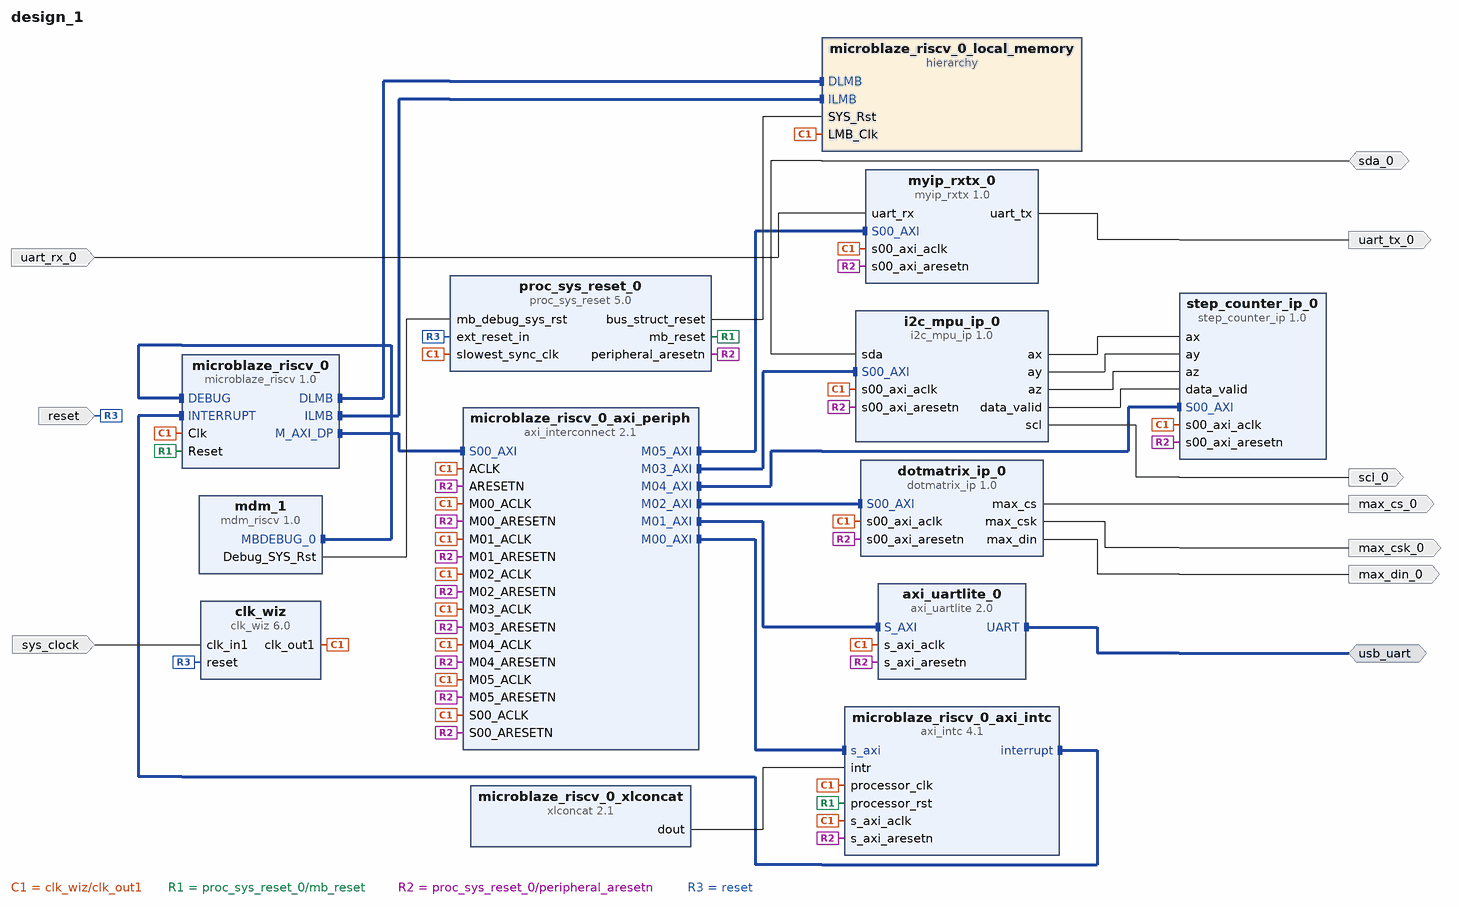
[diagram p0: block diagram of the top level]
# Vivado block design design_1, xc7a35tcpg236-1, Vivado 2024.2
create_bd_design design_1

create_bd_intf_port -mode Master -vlnv xilinx.com:interface:uart_rtl:1.0 usb_uart
create_bd_port -dir I -type rst reset
set_property -dict {CONFIG.POLARITY ACTIVE_HIGH} [get_bd_ports reset]
create_bd_port -dir I -type clk sys_clock
set_property -dict {CONFIG.FREQ_HZ 100000000 CONFIG.PHASE 0.0} [get_bd_ports sys_clock]
create_bd_port -dir O max_cs_0
create_bd_port -dir O max_csk_0
create_bd_port -dir O max_din_0
create_bd_port -dir O scl_0
create_bd_port -dir IO sda_0
create_bd_port -dir I uart_rx_0
create_bd_port -dir O uart_tx_0

create_bd_cell -type ip -vlnv xilinx.com:ip:proc_sys_reset:5.0 proc_sys_reset_0
set_property -dict {CONFIG.RESET_BOARD_INTERFACE reset CONFIG.USE_BOARD_FLOW true} [get_bd_cells proc_sys_reset_0]
create_bd_cell -type ip -vlnv xilinx.com:ip:clk_wiz:6.0 clk_wiz
set_property -dict [list \
  CONFIG.CLKOUT1_REQUESTED_OUT_FREQ 100.0 \
  CONFIG.CLK_IN1_BOARD_INTERFACE sys_clock \
  CONFIG.RESET_BOARD_INTERFACE reset \
  CONFIG.USE_BOARD_FLOW true \
] [get_bd_cells clk_wiz]
create_bd_cell -type ip -vlnv xilinx.com:ip:microblaze_riscv:1.0 microblaze_riscv_0
set_property -dict {CONFIG.C_DEBUG_ENABLED 1 CONFIG.C_D_AXI 1 CONFIG.C_D_LMB 1 CONFIG.C_I_LMB 1} [get_bd_cells microblaze_riscv_0]
create_bd_cell -type hier microblaze_riscv_0_local_memory
create_bd_cell -type ip -vlnv xilinx.com:ip:axi_interconnect:2.1 microblaze_riscv_0_axi_periph
set_property -dict {CONFIG.NUM_MI 6} [get_bd_cells microblaze_riscv_0_axi_periph]
create_bd_cell -type ip -vlnv xilinx.com:ip:axi_intc:4.1 microblaze_riscv_0_axi_intc
set_property -dict {CONFIG.C_HAS_FAST 1} [get_bd_cells microblaze_riscv_0_axi_intc]
create_bd_cell -type ip -vlnv xilinx.com:ip:xlconcat:2.1 microblaze_riscv_0_xlconcat
create_bd_cell -type ip -vlnv xilinx.com:ip:mdm_riscv:1.0 mdm_1
create_bd_cell -type ip -vlnv xilinx.com:ip:axi_uartlite:2.0 axi_uartlite_0
set_property -dict {CONFIG.UARTLITE_BOARD_INTERFACE usb_uart CONFIG.USE_BOARD_FLOW true} [get_bd_cells axi_uartlite_0]
create_bd_cell -type ip -vlnv user.org:user:dotmatrix_ip:1.0 dotmatrix_ip_0
create_bd_cell -type ip -vlnv user.org:user:i2c_mpu_ip:1.0 i2c_mpu_ip_0
create_bd_cell -type ip -vlnv user.org:user:step_counter_ip:1.0 step_counter_ip_0
create_bd_cell -type ip -vlnv user.org:user:myip_rxtx:1.0 myip_rxtx_0

# ---- hierarchy /microblaze_riscv_0_local_memory ----
current_bd_instance /microblaze_riscv_0_local_memory
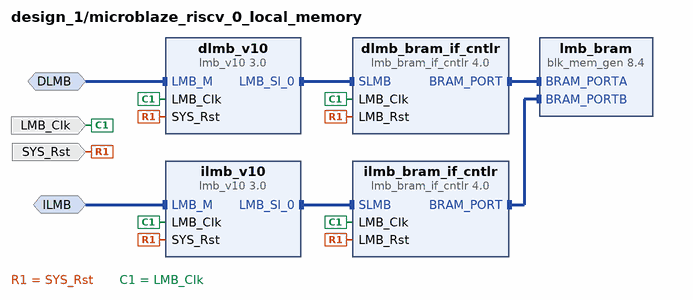
[diagram p1: block diagram inside /microblaze_riscv_0_local_memory]
create_bd_intf_pin -mode MirroredMaster -vlnv xilinx.com:interface:lmb_rtl:1.0 DLMB
create_bd_intf_pin -mode MirroredMaster -vlnv xilinx.com:interface:lmb_rtl:1.0 ILMB
create_bd_pin -dir I -type clk LMB_Clk
create_bd_pin -dir I -type rst SYS_Rst

create_bd_cell -type ip -vlnv xilinx.com:ip:lmb_v10:3.0 dlmb_v10
create_bd_cell -type ip -vlnv xilinx.com:ip:lmb_v10:3.0 ilmb_v10
create_bd_cell -type ip -vlnv xilinx.com:ip:lmb_bram_if_cntlr:4.0 dlmb_bram_if_cntlr
set_property -dict {CONFIG.C_ECC 0} [get_bd_cells dlmb_bram_if_cntlr]
create_bd_cell -type ip -vlnv xilinx.com:ip:lmb_bram_if_cntlr:4.0 ilmb_bram_if_cntlr
set_property -dict {CONFIG.C_ECC 0} [get_bd_cells ilmb_bram_if_cntlr]
create_bd_cell -type ip -vlnv xilinx.com:ip:blk_mem_gen:8.4 lmb_bram
set_property -dict {CONFIG.Memory_Type True_Dual_Port_RAM CONFIG.use_bram_block BRAM_Controller} [get_bd_cells lmb_bram]

# ---- connections ----

current_bd_instance /microblaze_riscv_0_local_memory
connect_bd_intf_net -intf_net microblaze_riscv_0_dlmb [get_bd_intf_pins dlmb_v10/LMB_M] [get_bd_intf_pins DLMB]
connect_bd_intf_net -intf_net microblaze_riscv_0_dlmb_bus [get_bd_intf_pins dlmb_v10/LMB_Sl_0] [get_bd_intf_pins dlmb_bram_if_cntlr/SLMB]
connect_bd_intf_net -intf_net microblaze_riscv_0_dlmb_cntlr [get_bd_intf_pins dlmb_bram_if_cntlr/BRAM_PORT] [get_bd_intf_pins lmb_bram/BRAM_PORTA]
connect_bd_intf_net -intf_net microblaze_riscv_0_ilmb [get_bd_intf_pins ilmb_v10/LMB_M] [get_bd_intf_pins ILMB]
connect_bd_intf_net -intf_net microblaze_riscv_0_ilmb_bus [get_bd_intf_pins ilmb_v10/LMB_Sl_0] [get_bd_intf_pins ilmb_bram_if_cntlr/SLMB]
connect_bd_intf_net -intf_net microblaze_riscv_0_ilmb_cntlr [get_bd_intf_pins ilmb_bram_if_cntlr/BRAM_PORT] [get_bd_intf_pins lmb_bram/BRAM_PORTB]
connect_bd_net [get_bd_pins SYS_Rst] \
  [get_bd_pins dlmb_v10/SYS_Rst] [get_bd_pins dlmb_bram_if_cntlr/LMB_Rst] [get_bd_pins ilmb_v10/SYS_Rst] \
  [get_bd_pins ilmb_bram_if_cntlr/LMB_Rst]
connect_bd_net -net microblaze_riscv_0_Clk [get_bd_pins LMB_Clk] \
  [get_bd_pins dlmb_v10/LMB_Clk] [get_bd_pins dlmb_bram_if_cntlr/LMB_Clk] [get_bd_pins ilmb_v10/LMB_Clk] \
  [get_bd_pins ilmb_bram_if_cntlr/LMB_Clk]
set_property HDL_ATTRIBUTE.BMM_INFO_ADDRESS_SPACE {byte  0x00000000 32 > design_1 microblaze_riscv_0_local_memory/lmb_bram} [get_bd_cells dlmb_bram_if_cntlr]
set_property HDL_ATTRIBUTE.KEEP_HIERARCHY yes [get_bd_cells dlmb_bram_if_cntlr]

current_bd_instance /
connect_bd_intf_net [get_bd_intf_ports usb_uart] [get_bd_intf_pins axi_uartlite_0/UART]
connect_bd_intf_net -intf_net microblaze_riscv_0_axi_dp [get_bd_intf_pins microblaze_riscv_0_axi_periph/S00_AXI] [get_bd_intf_pins microblaze_riscv_0/M_AXI_DP]
connect_bd_intf_net [get_bd_intf_pins microblaze_riscv_0_axi_periph/M01_AXI] [get_bd_intf_pins axi_uartlite_0/S_AXI]
connect_bd_intf_net [get_bd_intf_pins microblaze_riscv_0_axi_periph/M02_AXI] [get_bd_intf_pins dotmatrix_ip_0/S00_AXI]
connect_bd_intf_net [get_bd_intf_pins microblaze_riscv_0_axi_periph/M03_AXI] [get_bd_intf_pins i2c_mpu_ip_0/S00_AXI]
connect_bd_intf_net [get_bd_intf_pins microblaze_riscv_0_axi_periph/M04_AXI] [get_bd_intf_pins step_counter_ip_0/S00_AXI]
connect_bd_intf_net [get_bd_intf_pins microblaze_riscv_0_axi_periph/M05_AXI] [get_bd_intf_pins myip_rxtx_0/S00_AXI]
connect_bd_intf_net [get_bd_intf_pins mdm_1/MBDEBUG_0] [get_bd_intf_pins microblaze_riscv_0/DEBUG]
connect_bd_intf_net [get_bd_intf_pins microblaze_riscv_0/DLMB] [get_bd_intf_pins microblaze_riscv_0_local_memory/DLMB]
connect_bd_intf_net [get_bd_intf_pins microblaze_riscv_0/ILMB] [get_bd_intf_pins microblaze_riscv_0_local_memory/ILMB]
connect_bd_intf_net -intf_net microblaze_riscv_0_intc_axi [get_bd_intf_pins microblaze_riscv_0_axi_periph/M00_AXI] [get_bd_intf_pins microblaze_riscv_0_axi_intc/s_axi]
connect_bd_intf_net [get_bd_intf_pins microblaze_riscv_0_axi_intc/interrupt] [get_bd_intf_pins microblaze_riscv_0/INTERRUPT]
connect_bd_net [get_bd_ports sda_0] [get_bd_pins i2c_mpu_ip_0/sda]
connect_bd_net [get_bd_pins dotmatrix_ip_0/max_cs] [get_bd_ports max_cs_0]
connect_bd_net [get_bd_pins dotmatrix_ip_0/max_csk] [get_bd_ports max_csk_0]
connect_bd_net [get_bd_pins dotmatrix_ip_0/max_din] [get_bd_ports max_din_0]
connect_bd_net [get_bd_pins i2c_mpu_ip_0/ax] [get_bd_pins step_counter_ip_0/ax]
connect_bd_net [get_bd_pins i2c_mpu_ip_0/ay] [get_bd_pins step_counter_ip_0/ay]
connect_bd_net [get_bd_pins i2c_mpu_ip_0/az] [get_bd_pins step_counter_ip_0/az]
connect_bd_net [get_bd_pins i2c_mpu_ip_0/data_valid] [get_bd_pins step_counter_ip_0/data_valid]
connect_bd_net [get_bd_pins i2c_mpu_ip_0/scl] [get_bd_ports scl_0]
connect_bd_net [get_bd_pins mdm_1/Debug_SYS_Rst] [get_bd_pins proc_sys_reset_0/mb_debug_sys_rst]
connect_bd_net -net microblaze_riscv_0_Clk [get_bd_pins clk_wiz/clk_out1] \
  [get_bd_pins proc_sys_reset_0/slowest_sync_clk] [get_bd_pins microblaze_riscv_0/Clk] \
  [get_bd_pins microblaze_riscv_0_axi_periph/ACLK] [get_bd_pins microblaze_riscv_0_axi_periph/S00_ACLK] \
  [get_bd_pins microblaze_riscv_0_axi_periph/M00_ACLK] [get_bd_pins microblaze_riscv_0_axi_intc/s_axi_aclk] \
  [get_bd_pins microblaze_riscv_0_axi_intc/processor_clk] [get_bd_pins microblaze_riscv_0_local_memory/LMB_Clk] \
  [get_bd_pins axi_uartlite_0/s_axi_aclk] [get_bd_pins microblaze_riscv_0_axi_periph/M01_ACLK] \
  [get_bd_pins dotmatrix_ip_0/s00_axi_aclk] [get_bd_pins microblaze_riscv_0_axi_periph/M02_ACLK] \
  [get_bd_pins i2c_mpu_ip_0/s00_axi_aclk] [get_bd_pins microblaze_riscv_0_axi_periph/M03_ACLK] \
  [get_bd_pins microblaze_riscv_0_axi_periph/M04_ACLK] [get_bd_pins microblaze_riscv_0_axi_periph/M05_ACLK] \
  [get_bd_pins myip_rxtx_0/s00_axi_aclk] [get_bd_pins step_counter_ip_0/s00_axi_aclk]
connect_bd_net -net microblaze_riscv_0_intr [get_bd_pins microblaze_riscv_0_xlconcat/dout] [get_bd_pins microblaze_riscv_0_axi_intc/intr]
connect_bd_net [get_bd_pins myip_rxtx_0/uart_tx] [get_bd_ports uart_tx_0]
connect_bd_net [get_bd_pins proc_sys_reset_0/bus_struct_reset] [get_bd_pins microblaze_riscv_0_local_memory/SYS_Rst]
connect_bd_net [get_bd_pins proc_sys_reset_0/mb_reset] [get_bd_pins microblaze_riscv_0/Reset] [get_bd_pins microblaze_riscv_0_axi_intc/processor_rst]
connect_bd_net [get_bd_pins proc_sys_reset_0/peripheral_aresetn] \
  [get_bd_pins microblaze_riscv_0_axi_periph/ARESETN] [get_bd_pins microblaze_riscv_0_axi_periph/S00_ARESETN] \
  [get_bd_pins microblaze_riscv_0_axi_periph/M00_ARESETN] [get_bd_pins microblaze_riscv_0_axi_intc/s_axi_aresetn] \
  [get_bd_pins axi_uartlite_0/s_axi_aresetn] [get_bd_pins microblaze_riscv_0_axi_periph/M01_ARESETN] \
  [get_bd_pins dotmatrix_ip_0/s00_axi_aresetn] [get_bd_pins microblaze_riscv_0_axi_periph/M02_ARESETN] \
  [get_bd_pins i2c_mpu_ip_0/s00_axi_aresetn] [get_bd_pins microblaze_riscv_0_axi_periph/M03_ARESETN] \
  [get_bd_pins microblaze_riscv_0_axi_periph/M04_ARESETN] [get_bd_pins microblaze_riscv_0_axi_periph/M05_ARESETN] \
  [get_bd_pins myip_rxtx_0/s00_axi_aresetn] [get_bd_pins step_counter_ip_0/s00_axi_aresetn]
connect_bd_net [get_bd_ports reset] [get_bd_pins proc_sys_reset_0/ext_reset_in] [get_bd_pins clk_wiz/reset]
connect_bd_net [get_bd_ports sys_clock] [get_bd_pins clk_wiz/clk_in1]
connect_bd_net -net uart_rx_0_1 [get_bd_ports uart_rx_0] [get_bd_pins myip_rxtx_0/uart_rx]
set_property HDL_ATTRIBUTE.BMM_INFO_PROCESSOR {riscv > design_1 microblaze_riscv_0_local_memory/dlmb_bram_if_cntlr} [get_bd_cells microblaze_riscv_0]
set_property HDL_ATTRIBUTE.KEEP_HIERARCHY yes [get_bd_cells microblaze_riscv_0]

# ---- address map ----
assign_bd_address -offset 0x00000000 -range 128K -target_address_space [get_bd_addr_spaces microblaze_riscv_0/Data] [get_bd_addr_segs microblaze_riscv_0_local_memory/dlmb_bram_if_cntlr/SLMB/Mem]
assign_bd_address -offset 0x40600000 -range 64K -target_address_space [get_bd_addr_spaces microblaze_riscv_0/Data] [get_bd_addr_segs axi_uartlite_0/S_AXI/Reg]
assign_bd_address -offset 0x41200000 -range 64K -target_address_space [get_bd_addr_spaces microblaze_riscv_0/Data] [get_bd_addr_segs microblaze_riscv_0_axi_intc/S_AXI/Reg]
assign_bd_address -offset 0x44A00000 -range 64K -target_address_space [get_bd_addr_spaces microblaze_riscv_0/Data] [get_bd_addr_segs dotmatrix_ip_0/S00_AXI/S00_AXI_reg]
assign_bd_address -offset 0x44A10000 -range 64K -target_address_space [get_bd_addr_spaces microblaze_riscv_0/Data] [get_bd_addr_segs i2c_mpu_ip_0/S00_AXI/S00_AXI_reg]
assign_bd_address -offset 0x44A20000 -range 64K -target_address_space [get_bd_addr_spaces microblaze_riscv_0/Data] [get_bd_addr_segs step_counter_ip_0/S00_AXI/S00_AXI_reg]
assign_bd_address -offset 0x44A30000 -range 64K -target_address_space [get_bd_addr_spaces microblaze_riscv_0/Data] [get_bd_addr_segs myip_rxtx_0/S00_AXI/S00_AXI_reg]
assign_bd_address -offset 0x00000000 -range 128K -target_address_space [get_bd_addr_spaces microblaze_riscv_0/Instruction] [get_bd_addr_segs microblaze_riscv_0_local_memory/ilmb_bram_if_cntlr/SLMB/Mem]

validate_bd_design
save_bd_design
